# EasyEDA schematic SCH_Aquacontrol_2026-05-27.json
TITLE: Sheet_1; REV: 1.0; Date: 2026-03-22; Sheet: 1/1; Drawn By: kris.trompet; Company: Your Company
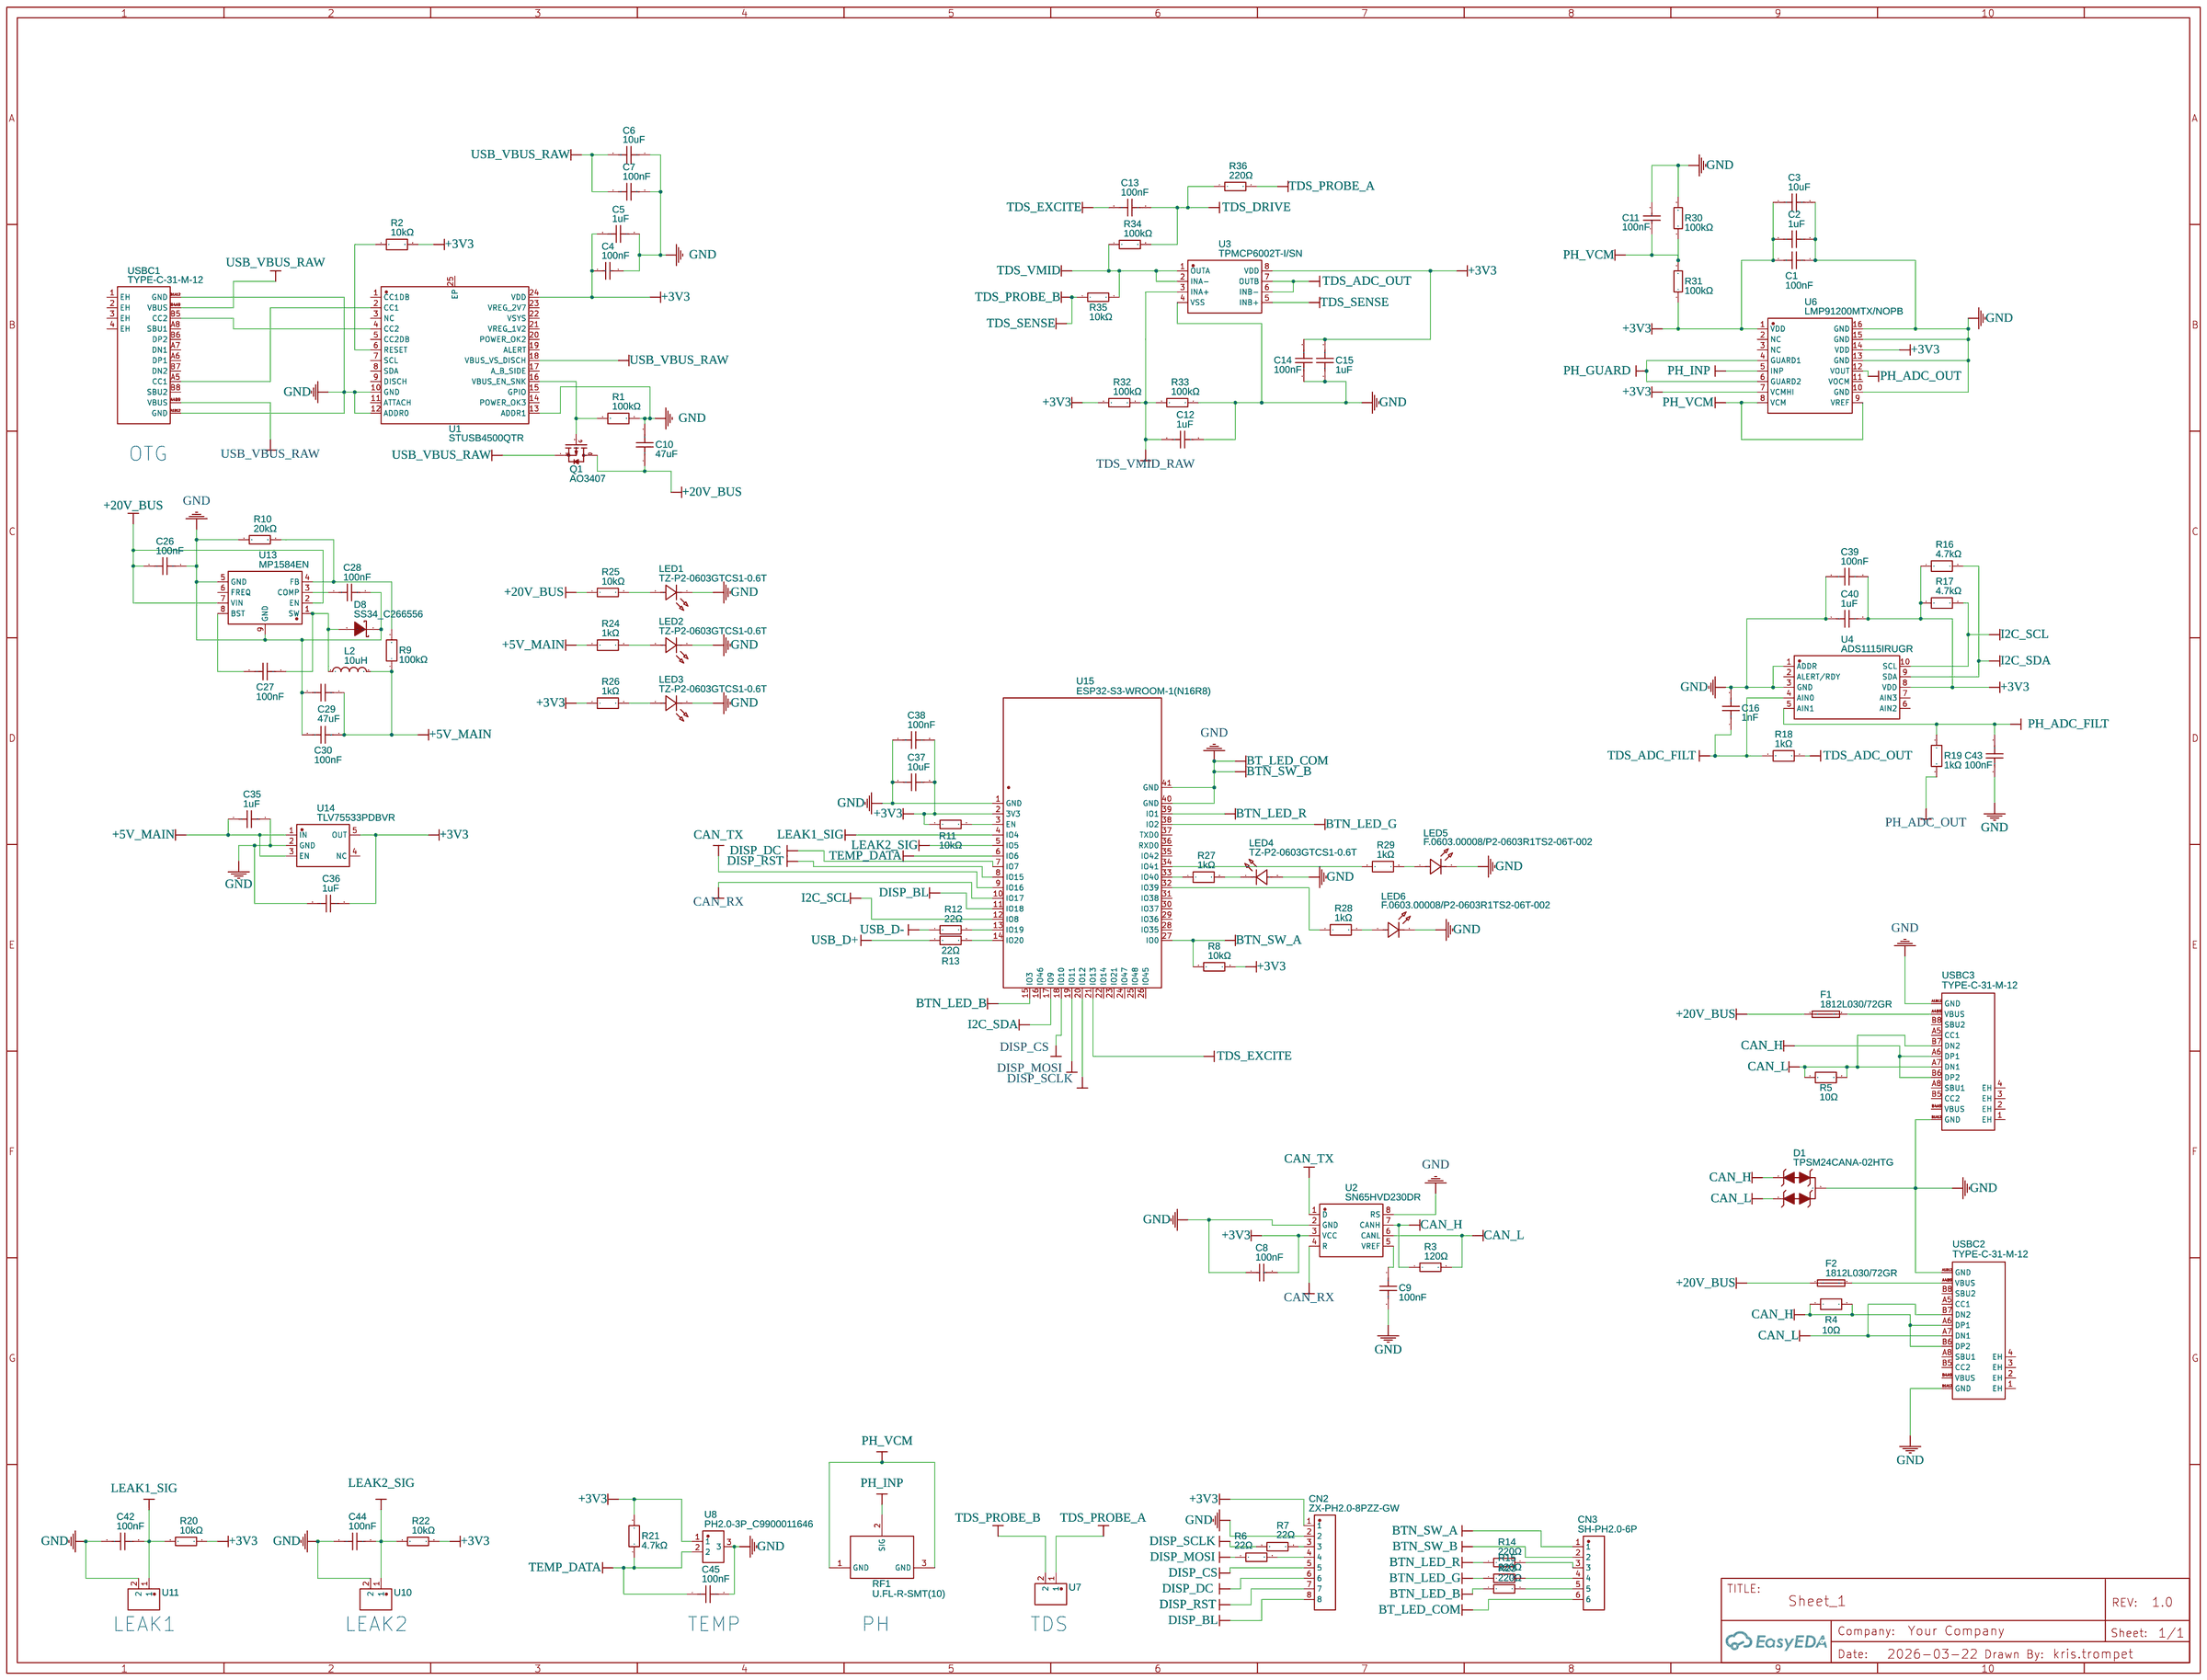
[diagram p0: schematic sheet]

## Parts
C1  100nF  [C0603]
C2  1uF  [C0603]
C3  10uF  [C0805]
C4  100nF  [C0603]
C5  1uF  [C0603]
C6  10uF  [C1206]
C7  100nF  [C0603]
C8  100nF  [C0603]
C9  100nF  [C0603]
C10  47uF  [C1206]
C11  100nF  [C0603]
C12  1uF  [C0603]
C13  100nF  [C0603]
C14  100nF  [C0603]
C15  1uF  [C0603]
C16  1nF  [C0603]
C26  100nF  [C0603]
C27  100nF  [C0603]
C28  100nF  [C0603]
C29  47uF  [C0603]
C30  100nF  [C0603]
C35  1uF  [C0603]
C36  1uF  [C0603]
C37  10uF  [C0805]
C38  100nF  [C0603]
C39  100nF  [C0603]
C40  1uF  [C0603]
C42  100nF  [C0603]
C43  100nF  [C0603]
C44  100nF  [C0603]
C45  100nF  [C0603]
CN2  ZX-PH2.0-8PZZ-GW  [CONN-TH_8P-P2.00_MEGASTAR_ZX-PH2.0-8PZZ-GW]
CN3  SH-PH2.0-6P  [CONN-TH_SH-PH2.0-6P]
D1  TPSM24CANA-02HTG  [SOT-23-3_L2.9-W1.3-P1.90-LS2.4-BR]
D8  SS34_C266556  [SMB_L4.6-W3.6-LS5.3-RD]
F1  1812L030/72GR  [F1812]
F2  1812L030/72GR  [F1812]
L2  10uH  [IND-SMD_L12.5-W12.5]
LED1  TZ-P2-0603GTCS1-0.6T  [LED0603-RD_GREEN]
LED2  TZ-P2-0603GTCS1-0.6T  [LED0603-RD_GREEN]
LED3  TZ-P2-0603GTCS1-0.6T  [LED0603-RD_GREEN]
LED4  TZ-P2-0603GTCS1-0.6T  [LED0603-RD_GREEN]
LED5  F.0603.00008/P2-0603R1TS2-06T-002  [LED0603_RED]
LED6  F.0603.00008/P2-0603R1TS2-06T-002  [LED0603_RED]
Q1  AO3407  [SOT-23-3_L2.9-W1.3-P1.90-LS2.4-BR]
R1  100kΩ  [R0603]
R2  10kΩ  [R0603]
R3  120Ω  [R0603]
R4  10Ω  [R0603]
R5  10Ω  [R0603]
R6  22Ω  [R0603]
R7  22Ω  [R0603]
R8  10kΩ  [R0603]
R9  100kΩ  [R0603]
R10  20kΩ  [R0603]
R11  10kΩ  [R0603]
R12  22Ω  [R0603]
R13  22Ω  [R0603]
R14  220Ω  [R0603]
R15  220Ω  [R0603]
R16  4.7kΩ  [R0603]
R17  4.7kΩ  [R0603]
R18  1kΩ  [R0603]
R19  1kΩ  [R0603]
R20  10kΩ  [R0603]
R21  4.7kΩ  [R0603]
R22  10kΩ  [R0603]
R23  220Ω  [R0603]
R24  1kΩ  [R0603]
R25  10kΩ  [R0603]
R26  1kΩ  [R0603]
R27  1kΩ  [R0603]
R28  1kΩ  [R0603]
R29  1kΩ  [R0603]
R30  100kΩ  [R0603]
R31  100kΩ  [R0603]
R32  100kΩ  [R0603]
R33  100kΩ  [R0603]
R34  100kΩ  [R0603]
R35  10kΩ  [R0603]
R36  220Ω  [R0603]
RF1  U.FL-R-SMT(10)  [ANT-SMD_UFL-R-SMT01]
U1  STUSB4500QTR  [QFN-24_L4.0-W4.0-P0.50-BL-EP2.8]
U2  SN65HVD230DR  [SOIC-8_L4.9-W3.9-P1.27-LS6.0-BL]
U3  TPMCP6002T-I/SN  [SOP-8_L4.9-W3.9-P1.27-LS6.0-BL]
U4  ADS1115IRUGR  [X2QFN-10_L2.0-W1.5-P0.50-BL]
U6  LMP91200MTX/NOPB  [TSSOP-16_L5.0-W4.4-P0.65-LS6.4-BL]
U7  PH2.0-2P_C9900095162  [CONN-TH_2P-P2.00_BOSSIE_BX-PH2.0-2PZZ]
U8  PH2.0-3P_C9900011646  [CONN-TH_3P-P2.00_HX20007-3A]
U10  PH2.0-2P_C9900095162  [CONN-TH_2P-P2.00_BOSSIE_BX-PH2.0-2PZZ]
U11  PH2.0-2P_C9900095162  [CONN-TH_2P-P2.00_BOSSIE_BX-PH2.0-2PZZ]
U13  MP1584EN  [SOIC-8_L4.9-W3.9-P1.27-LS6.0-BL-EP3.3]
U14  TLV75533PDBVR  [SOT-23-5_L3.0-W1.7-P0.95-LS2.8-BR]
U15  ESP32-S3-WROOM-1(N16R8)  [WIRELM-SMD_ESP32-S3-WROOM-1]
USBC1  TYPE-C-31-M-12  [USB-C_SMD-TYPE-C-31-M-12_1]
USBC2  TYPE-C-31-M-12  [USB-C_SMD-TYPE-C-31-M-12_1]
USBC3  TYPE-C-31-M-12  [USB-C_SMD-TYPE-C-31-M-12_1]

## Library data of the parts
C1 C26-C28 C30 = 0603B104J250NT: Supplier: LCSC; Supplier Part: C2991729; Manufacturer: FH(风华); Contributor: lcsc; JLCPCB Part Class: Extended Part
C2 C12 C15 C40 = TCC0603X5R105M250CT: Supplier: LCSC; Supplier Part: C6266891; Manufacturer: CCTC(三环); JLCPCB Part Class: Extended Part; Contributor: lcsc
C3 = 0805X5R106M500NT: Supplier: LCSC; Supplier Part: C49326683; Manufacturer: AIDE(爱迪电容); JLCPCB Part Class: Extended Part; Contributor: lcsc
C4 C8 = 06035C104KAT2A: Contributor: LCSC; Supplier: LCSC; Manufacturer: Kyocera AVX; Supplier Part: C88476; JLCPCB Part Class: Extended Part
C5 = 0603B105J160CT: Supplier: LCSC; Supplier Part: C3908272; Manufacturer: Walsin(华新科); JLCPCB Part Class: Extended Part; Contributor: lcsc
C6 = 1206B106K100NT: Contributor: LCSC; Supplier: LCSC; Manufacturer: FH(风华); Supplier Part: C165101; JLCPCB Part Class: Extended Part
C7 = 0603B104J500NT: Supplier: LCSC; Manufacturer: FH(风华); Supplier Part: C88136; JLCPCB Part Class: Extended Part
C9 C13 C14 C38 C39 C42-C45 = 0603X7R104K100NT: Supplier: LCSC; Supplier Part: C49326605; Manufacturer: AIDE(爱迪电容); JLCPCB Part Class: Extended Part; Contributor: lcsc
C10 = TCC1206X5R476M100HT: Supplier: LCSC; Supplier Part: C5448950; Manufacturer: CCTC(三环); JLCPCB Part Class: Extended Part; Contributor: lcsc
C11 = CT41G-0603-2X1-50V-0.1μF-K(N): Contributor: LCSC; Supplier: LCSC; Manufacturer: TORCH(火炬); Manufacturer Part: CT41G-0603-2X1-50V-0.1uF-K(N); Supplier Part: C125205; JLCPCB Part Class: Extended Part
C16 = AC0603KRX7R9BB102: Contributor: LCSC; Supplier: LCSC; Supplier Part: C277475; Manufacturer: YAGEO(国巨); JLCPCB Part Class: Extended Part
C29 = CGA0603X5R476M6R3JT: Supplier: LCSC; Supplier Part: C6119831; Manufacturer: HRE(芯声); Contributor: lcsc; JLCPCB Part Class: Extended Part
C35 C36 = CSA0603X5R105K160JT: Supplier: LCSC; Supplier Part: C3015156; Manufacturer: HRE(芯声); JLCPCB Part Class: Extended Part; Contributor: lcsc
C37 = CGA0805X7R106K100MT: Supplier: LCSC; Supplier Part: C23692979; Manufacturer: HRE(芯声); JLCPCB Part Class: Extended Part; Contributor: lcsc
CN2 = ZX-PH2.0-8PZZ-GW: Supplier: LCSC; Supplier Part: C42441499; Manufacturer: Megastar(兆星); JLCPCB Part Class: Extended Part; Contributor: lcsc
CN3 = SH-PH2.0-6P: Supplier: LCSC; Supplier Part: C53261228; Manufacturer: 深海电子; JLCPCB Part Class: Extended Part; Contributor: lcsc
D1 = TPSM24CANA-02HTG: Contributor: LCSC; Supplier: LCSC; Supplier Part: C970022; Manufacturer: TECH PUBLIC(台舟); JLCPCB Part Class: Extended Part
D8 = SS34_C266556: Contributor: LCSC; Supplier: LCSC; Supplier Part: C266556; Manufacturer: BORN(伯恩半导体); Manufacturer Part: SS34; JLCPCB Part Class: Extended Part
F1 F2 = 1812L030/72GR: Supplier: LCSC; Supplier Part: C36493865; Manufacturer: LUTE(陆特); JLCPCB Part Class: Extended Part; Contributor: lcsc
L2 = SMDRI129-100MT: Contributor: LCSC; Supplier: LCSC; Supplier Part: C2924825; Manufacturer: SXN(顺翔诺); JLCPCB Part Class: Extended Part
LED1-LED4 = TZ-P2-0603GTCS1-0.6T: Contributor: LCSC; Supplier: LCSC; Supplier Part: C779453; Manufacturer: TUOZHAN(拓展光电); JLCPCB Part Class: Extended Part
LED5 LED6 = F.0603.00008/P2-0603R1TS2-06T-002: Supplier: LCSC; Supplier Part: C7496810; Manufacturer: TUOZHAN(拓展光电); Contributor: lcsc; JLCPCB Part Class: Extended Part
Q1 = AO3407: Contributor: LCSC; Supplier: LCSC; Manufacturer: Hottech(合科泰); Supplier Part: C181093; JLCPCB Part Class: Extended Part
R1 = 0603WAD1003T5E: Supplier: LCSC; Supplier Part: C423093; Manufacturer: UNI-ROYAL(厚声); JLCPCB Part Class: Extended Part; Contributor: lcsc
R2 = AC0603DR-0710KL: Contributor: LCSC; Supplier: LCSC; Supplier Part: C227439; Manufacturer: YAGEO(国巨); JLCPCB Part Class: Extended Part
R3 = 0603WAF1200T5E: Supplier: LCSC; Manufacturer: UNI-ROYAL(厚声); Supplier Part: C22787; JLCPCB Part Class: Basic Part
R4 R5 = FRC0603F10R0TS: Supplier: LCSC; Supplier Part: C2906983; Manufacturer: FOJAN(富捷); Contributor: lcsc; JLCPCB Part Class: Extended Part
R6 R7 R12 R13 = RC0603FR-0722RL: Supplier: LCSC; Manufacturer: YAGEO(国巨); Supplier Part: C107701; JLCPCB Part Class: Extended Part
R8 R25 R35 = AT0603FRE0710KL: Contributor: lcsc; Supplier: LCSC; Supplier Part: C856609; Manufacturer: YAGEO(国巨); JLCPCB Part Class: Extended Part
R9 = RC0603FR-07100KP: Supplier: LCSC; Supplier Part: C20161673; Manufacturer: YAGEO(国巨); JLCPCB Part Class: Extended Part; Contributor: lcsc
R10 = AF0603FR-0720KL: Contributor: LCSC; Supplier: LCSC; Supplier Part: C144093; Manufacturer: YAGEO(国巨); JLCPCB Part Class: Extended Part
R11 R20 R22 = RT0603DRD0710KL: Contributor: LCSC; Supplier: LCSC; Manufacturer: YAGEO(国巨); Supplier Part: C136944; JLCPCB Part Class: Extended Part
R14 R15 R23 R36 = AC0603FR-07220RL: Supplier: LCSC; Manufacturer: YAGEO(国巨); Supplier Part: C138284; JLCPCB Part Class: Extended Part
R16 R17 R21 = HOLTT0603-1/10W-4.7K-1%: Contributor: LCSC; Supplier: LCSC; Supplier Part: C2904521; Manufacturer: Milliohm(毫欧); Manufacturer Part: HoLTT0603-1/10W-4.7K-1%; JLCPCB Part Class: Extended Part
R18 R19 R24 R26-R29 = RMC 0603 1K J N: Supplier: LCSC; Supplier Part: C5362357; Manufacturer: Tyohm(幸亚电阻); JLCPCB Part Class: Extended Part; Contributor: lcsc
R30-R34 = RT0603BRE07100KL: Contributor: LCSC; Supplier: LCSC; Supplier Part: C326758; Manufacturer: YAGEO(国巨); JLCPCB Part Class: Extended Part
RF1 = U.FL-R-SMT(10): Contributor: LCSC; Supplier: LCSC; Supplier Part: C434808; Manufacturer: HRS(广濑); JLCPCB Part Class: Extended Part
U1 = STUSB4500QTR: Contributor: LCSC; Supplier: LCSC; Supplier Part: C2678061; Manufacturer: ST(意法半导体); JLCPCB Part Class: Extended Part
U2 = SN65HVD230DR: Supplier: LCSC; Manufacturer: TI(德州仪器); Supplier Part: C12084; JLCPCB Part Class: Extended Part
U3 = TPMCP6002T-I/SN: Contributor: LCSC; Supplier: LCSC; Supplier Part: C2923397; Manufacturer: TECH PUBLIC(台舟); JLCPCB Part Class: Extended Part
U4 = ADS1115IRUGR: Contributor: LCSC; Supplier: LCSC; Supplier Part: C2651328; Manufacturer: TI(德州仪器); JLCPCB Part Class: Extended Part
U6 = LMP91200MTX/NOPB: Contributor: LCSC; Supplier: LCSC; Supplier Part: C2678419; Manufacturer: TI(德州仪器); JLCPCB Part Class: Extended Part
U7 U10 U11 = PH2.0-2P_C9900095162: Supplier: LCSC; Supplier Part: C9900095162; Manufacturer: null; Manufacturer Part: PH2.0-2P; JLCPCB Part Class: Extended Part; Contributor: lcsc
U8 = PH2.0-3P_C9900011646: Contributor: LCSC; Supplier: LCSC; Supplier Part: C9900011646; Manufacturer: null; Manufacturer Part: PH2.0-3P; JLCPCB Part Class: Extended Part
U13 = MP1584EN: Contributor: LCSC; Supplier: LCSC; Supplier Part: C454188; Manufacturer: null; JLCPCB Part Class: Extended Part
U14 = TLV75533PDBVR: Contributor: LCSC; Supplier: LCSC; Supplier Part: C404027; Manufacturer: TI(德州仪器); JLCPCB Part Class: Extended Part
U15 = ESP32-S3-WROOM-1(N16R8): Contributor: lcsc; Supplier: LCSC; Supplier Part: C2913202; Manufacturer: ESPRESSIF(乐鑫); Manufacturer Part: ESP32-S3-WROOM-1-N16R8; JLCPCB Part Class: Extended Part
USBC1-USBC3 = TYPE-C-31-M-12: Contributor: LCSC; Supplier: LCSC; Supplier Part: C165948; Manufacturer: 韩国韩荣; JLCPCB Part Class: Extended Part

## Nets
+3V3: C1.2 C2.1 C3.1 C4.1 C5.1 C8.2 C14.2 C15.2 C36.2 C37.2 C38.2 C39.2 C40.2 CN2.1 R2.2 R8.2 R11.1 R16.1 R17.1 R20.2 R21.2 R22.2 R26.1 R31.1 R32.1 U1.24(VDD) U2.3(VCC) U3.8(VDD) U4.8(VDD) U6.1(VDD) U6.7(VCMHI) U6.14(VDD) U8.1 U14.5(OUT) U15.2(3V3)
+5V_MAIN: C29.1 C30.1 C35.1 L2.2 R9.1 R24.1 U14.1(IN) U14.3(EN)
+20V_BUS: C10.1 C26.2 F1.1 F2.1 Q1.3(D) R25.1 U13.2(EN) U13.7(VIN)
BTN_LED_B: R23.1 U15.15(IO3)
BTN_LED_G: R15.1 U15.38(IO2)
BTN_LED_R: R14.1 U15.39(IO1)
BTN_SW_A: CN3.1 R8.1 U15.27(IO0)
BTN_SW_B: C1.1 C2.2 C3.2 C4.2 C5.2 C6.1 C7.2 C8.1 C9.2 C10.2 C11.2 C12.2 C14.1 C15.1 C16.2 C26.1 C28.2 C29.2 C30.2 C35.2 C36.1 C37.1 C38.1 C39.1 C40.1 C42.1 C43.1 C44.1 C45.2 CN2.2 CN3.2 CN3.6 D1.3 D8.1(C) LED1.1(-) LED2.1(-) LED3.1(-) LED4.2(+) LED5.2(-) LED6.2(-) R1.2 R10.1 R30.2 R33.2 U1.10(GND) U1.12(ADDR0) U1.13(ADDR1) U2.2(GND) U2.8(RS) U3.4(VSS) U4.1(ADDR) U4.3(GND) U6.10(GND) U6.13(GND) U6.15(GND) U6.16(GND) U8.3 U10.2 U11.2 U13.5(GND) U13.9(GND) U14.2(GND) U15.1(GND) U15.40(GND) U15.41(GND) USBC1.A1B12(GND) USBC1.B1A12(GND) USBC2.A1B12(GND) USBC2.B1A12(GND) USBC3.A1B12(GND) USBC3.B1A12(GND)
CAN_H: D1.1 R3.1 R4.1 R4.2 U2.7(CANH) USBC2.A6(DP1) USBC2.B6(DP2) USBC3.A6(DP1) USBC3.B6(DP2)
CAN_L: D1.2 R3.2 R5.1 R5.2 U2.6(CANL) USBC2.A7(DN1) USBC2.B7(DN2) USBC3.A7(DN1) USBC3.B7(DN2)
CAN_RX: U2.4(R) U15.10(IO17)
CAN_TX: U2.1(D) U15.9(IO16)
DISP_BL: CN2.8 U15.11(IO18)
DISP_CS: CN2.5 U15.18(IO10)
DISP_DC: CN2.6 U15.7(IO7)
DISP_MOSI: R6.1 U15.19(IO11)
DISP_RST: CN2.7 U15.8(IO15)
DISP_SCLK: R7.1 U15.20(IO12)
I2C_SCL: R17.2 U4.10(SCL) U15.12(IO8)
I2C_SDA: R16.2 U4.9(SDA) U15.17(IO9)
LEAK1_SIG: C42.2 R20.1 U11.1 U15.4(IO4)
LEAK2_SIG: C44.2 R22.1 U10.1 U15.5(IO5)
PH_ADC_FILT: C43.2 R19.1 U4.5(AIN1)
PH_ADC_OUT: R19.2 U6.12(VOUT)
PH_GUARD: U6.4(GUARD1) U6.6(GUARD2)
PH_INP: RF1.2(SIG) U6.5(INP)
PH_VCM: C11.1 R30.1 R31.2 RF1.1(GND) RF1.3(GND) U6.8(VCM) U6.9(VREF)
TDS_ADC_FILT: C16.1 R18.2 U4.4(AIN0)
TDS_ADC_OUT: R18.1 U3.6(INB-) U3.7(OUTB)
TDS_DRIVE: C13.1 R34.2 R36.1
TDS_EXCITE: C13.2 U15.21(IO13)
TDS_PROBE_A: R36.2 U7.1
TDS_PROBE_B: R35.1 U3.5(INB+) U7.2
TDS_VMID: R34.1 R35.2 U3.1(OUTA) U3.2(INA-)
TDS_VMID_RAW: C12.1 R32.2 R33.1 U3.3(INA+)
TEMP_DATA: C45.1 R21.1 U8.2 U15.6(IO6)
USB_D+: R13.1
USB_D-: R12.1
USB_VBUS_RAW: C6.2 C7.1 Q1.2(S) U1.18(VBUS_VS_DISCH) USBC1.A4B9(VBUS) USBC1.B4A9(VBUS)
Net-(C9-1): C9.1 U2.5(VREF)
Net-(C27-1): C27.1 D8.2(A) L2.1 U13.1(SW)
Net-(C27-2): C27.2 U13.8(BST)
Net-(C28-1): C28.1 U13.3(COMP)
Net-(CN2-3): CN2.3 R7.2
Net-(CN2-4): CN2.4 R6.2
Net-(CN3-3): CN3.3 R14.2
Net-(CN3-4): CN3.4 R15.2
Net-(CN3-5): CN3.5 R23.2
Net-(F1-2): F1.2 USBC3.A4B9(VBUS)
Net-(F2-2): F2.2 USBC2.A4B9(VBUS)
Net-(LED1-2): LED1.2(+) R25.2
Net-(LED2-2): LED2.2(+) R24.2
Net-(LED3-2): LED3.2(+) R26.2
Net-(LED4-1): LED4.1(-) R27.2
Net-(LED5-1): LED5.1(+) R29.2
Net-(LED6-1): LED6.1(+) R28.2
Net-(Q1-1): Q1.1(G) R1.1 U1.16(VBUS_EN_SNK)
Net-(R2-1): R2.1 U1.6(RESET)
Net-(R9-2): R9.2 R10.2 U13.4(FB)
Net-(R11-2): R11.2 U15.3(EN)
Net-(R12-2): R12.2 U15.13(IO19)
Net-(R13-2): R13.2 U15.14(IO20)
Net-(R27-1): R27.1 U15.33(IO40)
Net-(R28-1): R28.1 U15.32(IO39)
Net-(R29-1): R29.1 U15.34(IO41)
Net-(U1-2): U1.2(CC1) USBC1.A5(CC1)
Net-(U1-4): U1.4(CC2) USBC1.B5(CC2)

Not connected (* = marked no-connect by the designer): U1 1(CC1DB) 3(NC) 5(CC2DB) 7(SCL) 8(SDA) 9(DISCH) 11(ATTACH) 14(POWER_OK3) 15(GPIO) 17(A_B_SIDE) 19(ALERT) 20(POWER_OK2) 21(VREG_1V2) 22(VSYS) 23(VREG_2V7) 25(EP); U4 2(ALERT/RDY) 6(AIN2) 7(AIN3); U6 2(NC) 3(NC) 11(VOCM); U13 6(FREQ); U14 4(NC); U15 16(IO46) 22(IO14) 23(IO21) 24(IO47) 25(IO48) 26(IO45) 28(IO35) 29(IO36) 30(IO37) 31(IO38) 35(IO42) 36(RXD0) 37(TXD0); USBC1 1(EH) 2(EH) 3(EH) 4(EH) A6(DP1) A7(DN1) A8(SBU1) B6(DP2) B7(DN2) B8(SBU2); USBC2 1(EH) 2(EH) 3(EH) 4(EH) A5(CC1) A8(SBU1) B4A9(VBUS) B5(CC2) B8(SBU2); USBC3 1(EH) 2(EH) 3(EH) 4(EH) A5(CC1) A8(SBU1) B4A9(VBUS) B5(CC2) B8(SBU2)

## Notes on the sheet
- OTG
- LEAK1
- LEAK2
- TEMP
- PH
- TDS
